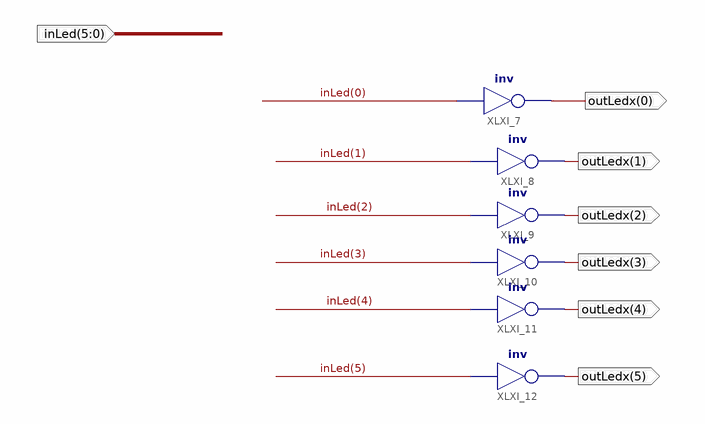
[diagram p0: schematic sheet 1]
// Xilinx ISE schematic ledTest.sch (spartan6) as structural Verilog: 6 symbols, 7 ports
module ledTest (
  input  [5:0] inLed,
  output [5:0] outLedx
);

  not XLXI_7 (outLedx[0], inLed[0]);
  not XLXI_8 (outLedx[1], inLed[1]);
  not XLXI_9 (outLedx[2], inLed[2]);
  not XLXI_10 (outLedx[3], inLed[3]);
  not XLXI_11 (outLedx[4], inLed[4]);
  not XLXI_12 (outLedx[5], inLed[5]);
endmodule
